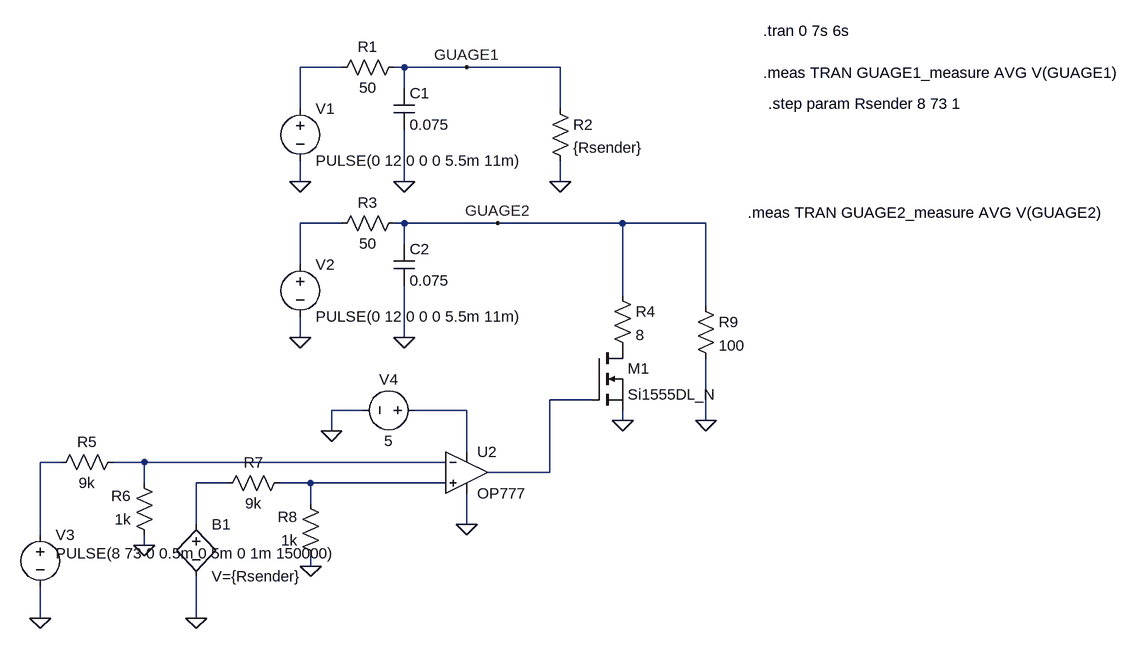
[diagram p0: schematic gauges.asc]
gauges.asc, the LTspice schematic file:
Version 4.1
SHEET 1 1268 868
WIRE 64 0 0 0
WIRE 160 0 144 0
WIRE 256 0 160 0
WIRE 400 0 256 0
WIRE 160 32 160 0
WIRE 0 64 0 0
WIRE 400 64 400 0
WIRE 0 176 0 144
WIRE 160 176 160 96
WIRE 400 176 400 144
WIRE 64 240 0 240
WIRE 160 240 144 240
WIRE 304 240 160 240
WIRE 496 240 304 240
WIRE 624 240 496 240
WIRE 160 272 160 240
WIRE 0 304 0 240
WIRE 496 352 496 240
WIRE 624 368 624 240
WIRE 0 416 0 384
WIRE 160 416 160 336
WIRE 448 512 384 512
WIRE 96 528 48 528
WIRE 256 528 176 528
WIRE 496 544 496 528
WIRE 624 544 624 448
WIRE 48 560 48 528
WIRE 256 592 256 528
WIRE -368 608 -400 608
WIRE -240 608 -288 608
WIRE 224 608 -240 608
WIRE 384 624 384 512
WIRE 384 624 288 624
WIRE -240 640 -240 608
WIRE -112 640 -160 640
WIRE 16 640 -32 640
WIRE 224 640 16 640
WIRE 16 672 16 640
WIRE -160 704 -160 640
WIRE 256 704 256 656
WIRE -400 720 -400 608
WIRE -240 736 -240 720
WIRE 16 768 16 752
WIRE -400 848 -400 800
WIRE -160 848 -160 784
FLAG 0 176 0
FLAG 400 176 0
FLAG 160 176 0
FLAG 256 0 GUAGE1
FLAG 0 416 0
FLAG 160 416 0
FLAG 496 544 0
FLAG -400 848 0
FLAG -160 848 0
FLAG 256 704 0
FLAG 48 560 0
FLAG 304 240 GUAGE2
FLAG -240 736 0
FLAG 16 768 0
FLAG 624 544 0
SYMBOL res 160 -16 R90
WINDOW 0 0 56 VBottom 2
WINDOW 3 32 56 VTop 2
SYMATTR InstName R1
SYMATTR Value 50
SYMBOL voltage 0 48 R0
WINDOW 123 0 0 Left 0
WINDOW 39 0 0 Left 0
SYMATTR InstName V1
SYMATTR Value PULSE(0 12 0 0 0 5.5m 11m)
SYMBOL res 384 48 R0
SYMATTR InstName R2
SYMATTR Value {Rsender}
SYMBOL cap 144 32 R0
SYMATTR InstName C1
SYMATTR Value 0.075
SYMBOL res 160 224 R90
WINDOW 0 0 56 VBottom 2
WINDOW 3 32 56 VTop 2
SYMATTR InstName R3
SYMATTR Value 50
SYMBOL voltage 0 288 R0
WINDOW 123 0 0 Left 0
WINDOW 39 0 0 Left 0
SYMATTR InstName V2
SYMATTR Value PULSE(0 12 0 0 0 5.5m 11m)
SYMBOL cap 144 272 R0
SYMATTR InstName C2
SYMATTR Value 0.075
SYMBOL res 480 336 R0
SYMATTR InstName R4
SYMATTR Value 8
SYMBOL nmos 448 432 R0
SYMATTR InstName M1
SYMATTR Value Si1555DL_N
SYMBOL voltage -400 704 R0
WINDOW 3 24 44 Left 2
WINDOW 123 0 0 Left 0
WINDOW 39 24 72 Left 2
SYMATTR Value PULSE(8 73 0 0.5m 0.5m 0 1m 150000)
SYMATTR InstName V3
SYMBOL bv -160 688 R0
SYMATTR InstName B1
SYMATTR Value V={Rsender}
SYMBOL voltage 192 528 R90
WINDOW 0 -32 56 VBottom 2
WINDOW 3 32 56 VTop 2
WINDOW 123 0 0 Left 0
WINDOW 39 0 0 Left 0
SYMATTR InstName V4
SYMATTR Value 5
SYMBOL res -272 592 R90
WINDOW 0 0 56 VBottom 2
WINDOW 3 32 56 VTop 2
SYMATTR InstName R5
SYMATTR Value 9k
SYMBOL res -224 736 R180
WINDOW 0 36 76 Left 2
WINDOW 3 36 40 Left 2
SYMATTR InstName R6
SYMATTR Value 1k
SYMBOL res -16 624 R90
WINDOW 0 0 56 VBottom 2
WINDOW 3 32 56 VTop 2
SYMATTR InstName R7
SYMATTR Value 9k
SYMBOL res 32 768 R180
WINDOW 0 36 76 Left 2
WINDOW 3 36 40 Left 2
SYMATTR InstName R8
SYMATTR Value 1k
SYMBOL OpAmps\\OP777 256 560 R0
SYMATTR InstName U2
SYMBOL res 608 352 R0
SYMATTR InstName R9
SYMATTR Value 100
TEXT 712 -56 Left 2 !.tran 0 7s 6s
TEXT 720 56 Left 2 !.step param Rsender 8 73 1
TEXT 712 8 Left 2 !.meas TRAN GUAGE1_measure AVG V(GUAGE1)
TEXT 688 224 Left 2 !.meas TRAN GUAGE2_measure AVG V(GUAGE2)

The netlist it stands for:
* gauges.asc
R1 GUAGE1 N001 50
V1 N001 0 PULSE(0 12 0 0 0 5.5m 11m)
R2 GUAGE1 0 {Rsender}
C1 GUAGE1 0 0.075
R3 GUAGE2 N002 50
V2 N002 0 PULSE(0 12 0 0 0 5.5m 11m)
C2 GUAGE2 0 0.075
R4 GUAGE2 P001 8
M1 P001 N003 0 0 Si1555DL_N
V3 N005 0 PULSE(8 73 0 0.5m 0.5m 0 1m 150000)
B1 N007 0 V={Rsender}
V4 N004 0 5
R5 N006 N005 9k
R6 0 N006 1k
R7 N008 N007 9k
R8 0 N008 1k
X§U2 N008 N006 N004 0 N003 OP777  ; pins In+ In- V+ V- OUT
R9 GUAGE2 0 100
.model NMOS NMOS
.model PMOS PMOS
.lib standard.mos
.tran 0 7s 6s
.step param Rsender 8 73 1
.meas TRAN GUAGE1_measure AVG V(GUAGE1)
.meas TRAN GUAGE2_measure AVG V(GUAGE2)
.lib ADI.lib
.backanno
.end